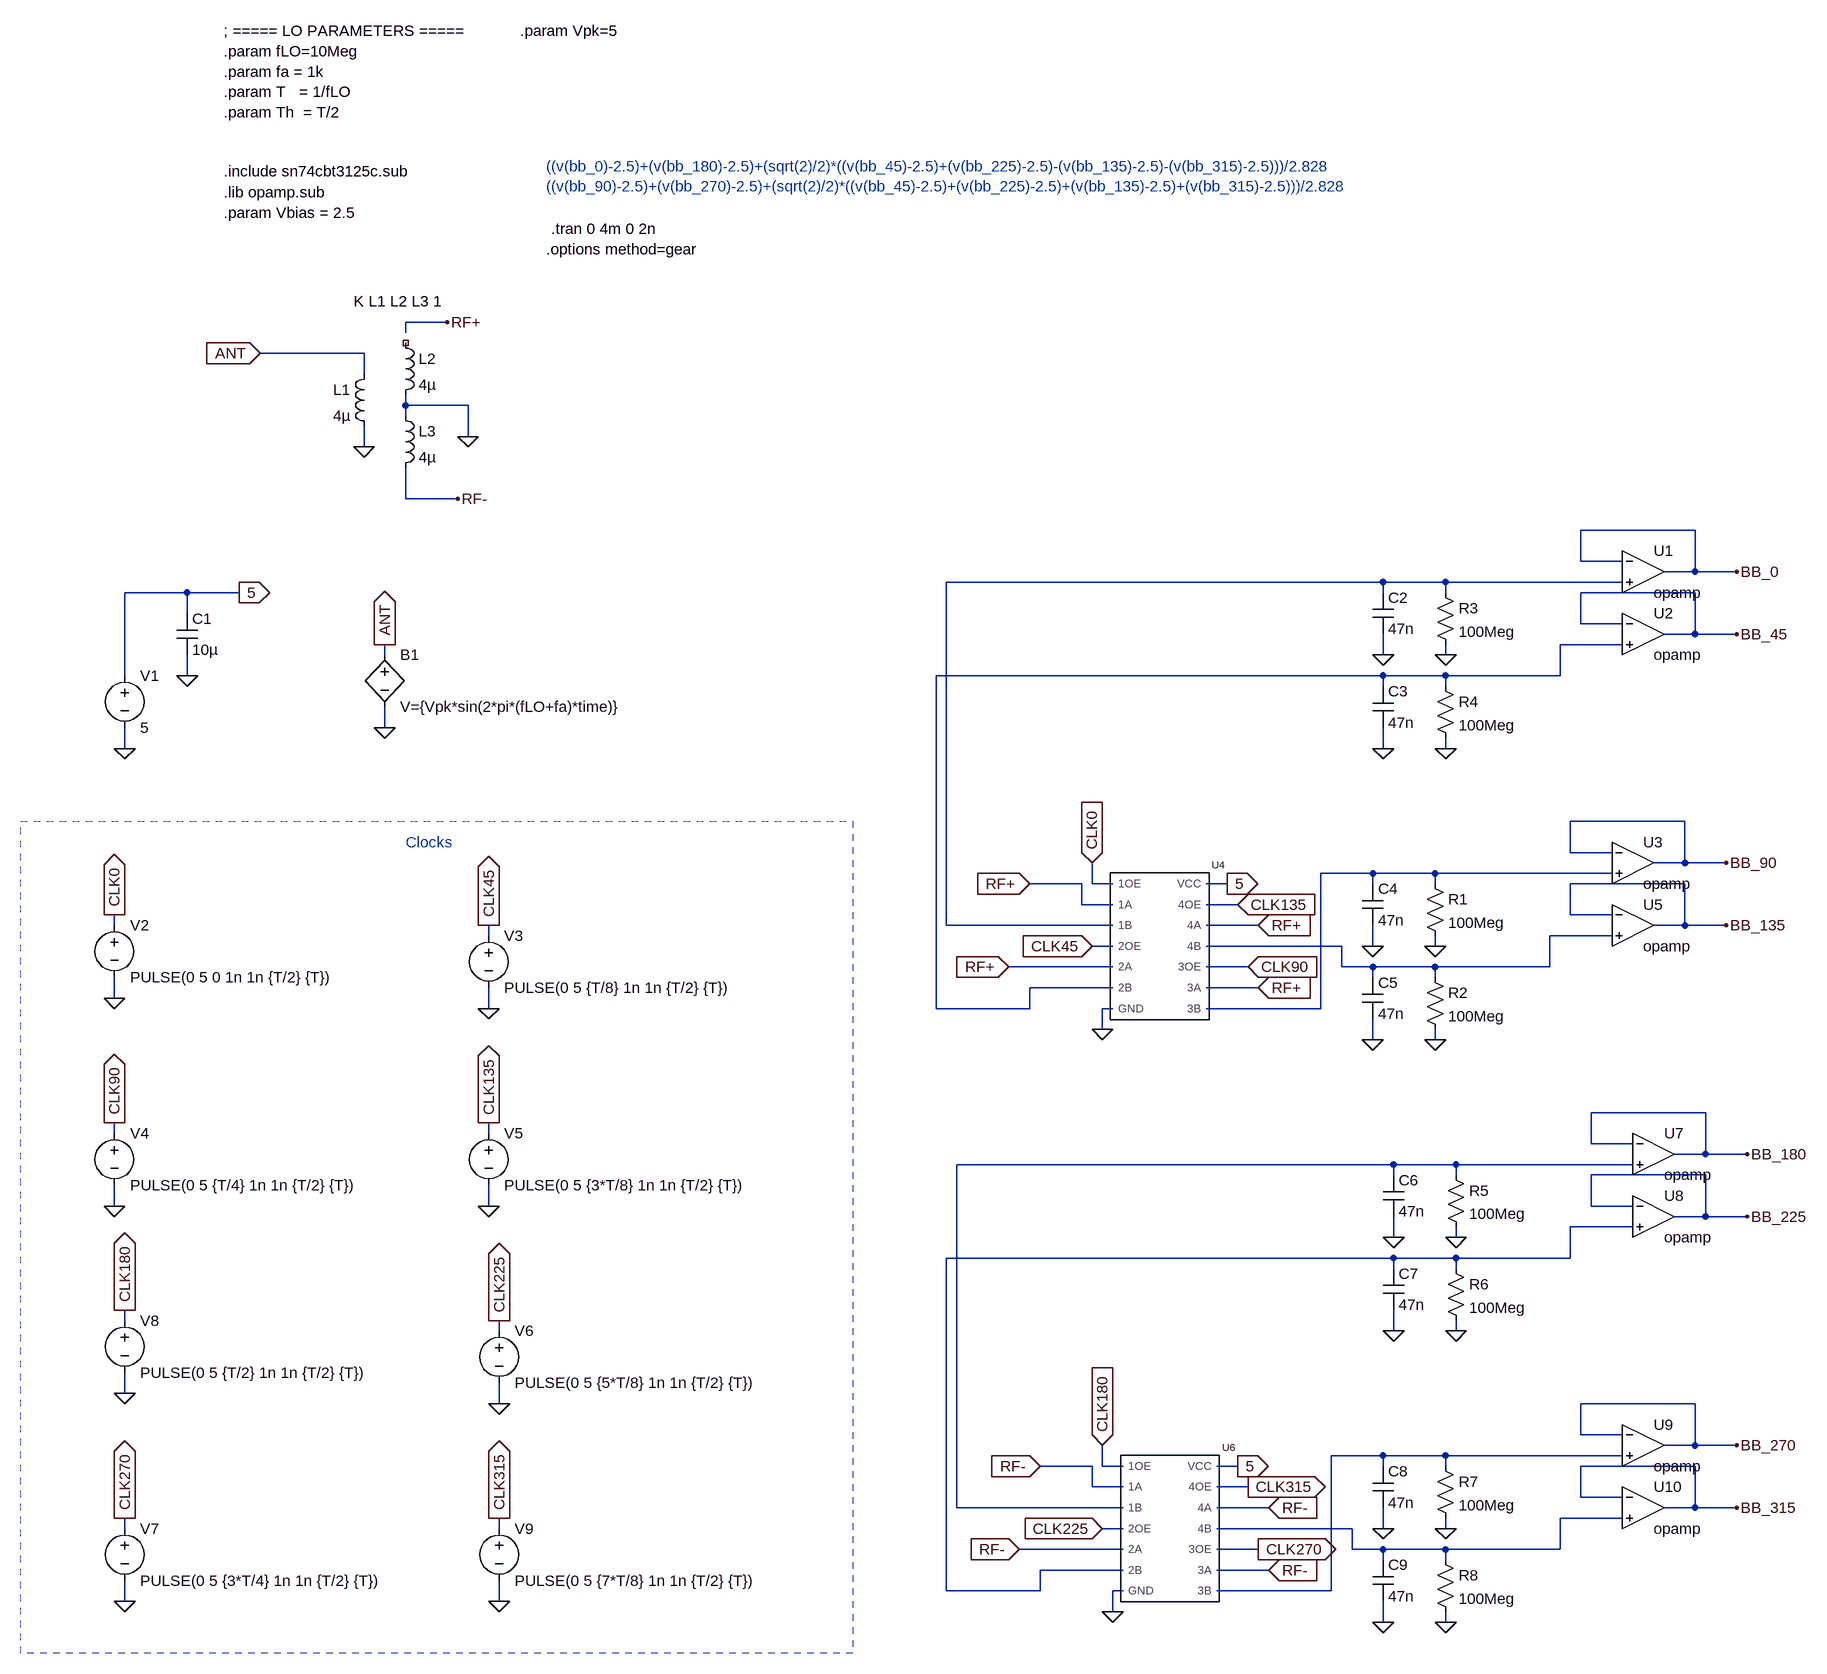
[diagram p0: schematic sn74cbt3125c_8_channel_no_differential.asc]
sn74cbt3125c_8_channel_no_differential.asc, the LTspice schematic file:
Version 4.1
SHEET 1 2428 2448
WIRE 320 -656 256 -656
WIRE 256 -640 256 -656
WIRE 192 -608 32 -608
WIRE 192 -576 192 -608
WIRE 256 -528 256 -544
WIRE 352 -528 256 -528
WIRE 256 -512 256 -528
WIRE 352 -480 352 -528
WIRE 192 -464 192 -496
WIRE 256 -384 256 -432
WIRE 336 -384 256 -384
WIRE 2240 -336 2064 -336
WIRE 2064 -288 2064 -336
WIRE 2128 -288 2064 -288
WIRE 2240 -272 2240 -336
WIRE 2240 -272 2192 -272
WIRE 2304 -272 2240 -272
WIRE 1760 -256 1088 -256
WIRE 1856 -256 1760 -256
WIRE 2128 -256 1856 -256
WIRE -80 -240 -176 -240
WIRE 0 -240 -80 -240
WIRE 1760 -240 1760 -256
WIRE 1856 -240 1856 -256
WIRE 2240 -240 2064 -240
WIRE -80 -208 -80 -240
WIRE 2064 -192 2064 -240
WIRE 2128 -192 2064 -192
WIRE 2240 -176 2240 -240
WIRE 2240 -176 2192 -176
WIRE 2304 -176 2240 -176
WIRE 2128 -160 2032 -160
WIRE 224 -144 224 -160
WIRE 1760 -144 1760 -176
WIRE 1856 -144 1856 -160
WIRE -176 -112 -176 -240
WIRE -80 -112 -80 -144
WIRE 1760 -112 1072 -112
WIRE 1856 -112 1760 -112
WIRE 2032 -112 2032 -160
WIRE 2032 -112 1856 -112
WIRE 1760 -96 1760 -112
WIRE 1856 -96 1856 -112
WIRE 224 -32 224 -64
WIRE -176 0 -176 -32
WIRE 1760 0 1760 -32
WIRE 1856 0 1856 -16
WIRE 2224 112 2048 112
WIRE 2048 160 2048 112
WIRE 2112 160 2048 160
WIRE 2224 176 2224 112
WIRE 2224 176 2176 176
WIRE 2288 176 2224 176
WIRE 1744 192 1664 192
WIRE 1840 192 1744 192
WIRE 2112 192 1840 192
WIRE 1296 208 1216 208
WIRE 1312 208 1312 176
WIRE 1344 208 1312 208
WIRE 1520 208 1488 208
WIRE 1744 208 1744 192
WIRE 1840 208 1840 192
WIRE 2224 208 2048 208
WIRE 1296 240 1296 208
WIRE 1344 240 1296 240
WIRE 1536 240 1488 240
WIRE 2048 256 2048 208
WIRE 2112 256 2048 256
WIRE -192 272 -192 256
WIRE 1088 272 1088 -256
WIRE 1344 272 1088 272
WIRE 1568 272 1488 272
WIRE 2224 272 2224 208
WIRE 2224 272 2176 272
WIRE 2288 272 2224 272
WIRE 384 288 384 272
WIRE 2112 288 2016 288
WIRE 1344 304 1312 304
WIRE 1696 304 1488 304
WIRE 1744 304 1744 272
WIRE 1840 304 1840 288
WIRE 1344 336 1184 336
WIRE 1552 336 1488 336
WIRE 1696 336 1696 304
WIRE 1744 336 1696 336
WIRE 1840 336 1744 336
WIRE 2016 336 2016 288
WIRE 2016 336 1840 336
WIRE 1744 352 1744 336
WIRE 1840 352 1840 336
WIRE 1344 368 1216 368
WIRE 1568 368 1488 368
WIRE -192 384 -192 352
WIRE 384 400 384 368
WIRE 1072 400 1072 -112
WIRE 1216 400 1216 368
WIRE 1216 400 1072 400
WIRE 1344 400 1328 400
WIRE 1664 400 1664 192
WIRE 1664 400 1488 400
WIRE 1328 432 1328 400
WIRE 1744 448 1744 416
WIRE 1840 448 1840 432
WIRE 2256 560 2080 560
WIRE -192 592 -192 576
WIRE 384 592 384 576
WIRE 2080 608 2080 560
WIRE 2144 608 2080 608
WIRE 2256 624 2256 560
WIRE 2256 624 2208 624
WIRE 2320 624 2256 624
WIRE 1776 640 1104 640
WIRE 1872 640 1776 640
WIRE 2144 640 1872 640
WIRE 1776 656 1776 640
WIRE 1872 656 1872 640
WIRE 2256 656 2080 656
WIRE -192 704 -192 672
WIRE 384 704 384 672
WIRE 2080 704 2080 656
WIRE 2144 704 2080 704
WIRE 2256 720 2256 656
WIRE 2256 720 2208 720
WIRE 2320 720 2256 720
WIRE 2144 736 2048 736
WIRE 1776 752 1776 720
WIRE 1872 752 1872 736
WIRE 1776 784 1088 784
WIRE 1872 784 1776 784
WIRE 2048 784 2048 736
WIRE 2048 784 1872 784
WIRE 1776 800 1776 784
WIRE 1872 800 1872 784
WIRE -176 880 -176 864
WIRE 400 896 400 880
WIRE 1776 896 1776 864
WIRE 1872 896 1872 880
WIRE -176 992 -176 960
WIRE 400 1008 400 976
WIRE 2240 1008 2064 1008
WIRE 2064 1056 2064 1008
WIRE 2128 1056 2064 1056
WIRE 2240 1072 2240 1008
WIRE 2240 1072 2192 1072
WIRE 2304 1072 2240 1072
WIRE 1760 1088 1680 1088
WIRE 1856 1088 1760 1088
WIRE 2128 1088 1856 1088
WIRE 1312 1104 1232 1104
WIRE 1328 1104 1328 1072
WIRE 1360 1104 1328 1104
WIRE 1536 1104 1504 1104
WIRE 1760 1104 1760 1088
WIRE 1856 1104 1856 1088
WIRE 2240 1104 2064 1104
WIRE 1312 1136 1312 1104
WIRE 1360 1136 1312 1136
WIRE 1552 1136 1504 1136
WIRE 2064 1152 2064 1104
WIRE 2128 1152 2064 1152
WIRE 1104 1168 1104 640
WIRE 1360 1168 1104 1168
WIRE 1584 1168 1504 1168
WIRE 2240 1168 2240 1104
WIRE 2240 1168 2192 1168
WIRE 2304 1168 2240 1168
WIRE 2128 1184 2032 1184
WIRE -176 1200 -176 1184
WIRE 400 1200 400 1184
WIRE 1360 1200 1328 1200
WIRE 1712 1200 1504 1200
WIRE 1760 1200 1760 1168
WIRE 1856 1200 1856 1184
WIRE 1360 1232 1200 1232
WIRE 1568 1232 1504 1232
WIRE 1712 1232 1712 1200
WIRE 1760 1232 1712 1232
WIRE 1856 1232 1760 1232
WIRE 2032 1232 2032 1184
WIRE 2032 1232 1856 1232
WIRE 1760 1248 1760 1232
WIRE 1856 1248 1856 1232
WIRE 1360 1264 1232 1264
WIRE 1584 1264 1504 1264
WIRE 1088 1296 1088 784
WIRE 1232 1296 1232 1264
WIRE 1232 1296 1088 1296
WIRE 1360 1296 1344 1296
WIRE 1680 1296 1680 1088
WIRE 1680 1296 1504 1296
WIRE -176 1312 -176 1280
WIRE 400 1312 400 1280
WIRE 1344 1328 1344 1296
WIRE 1760 1344 1760 1312
WIRE 1856 1344 1856 1328
FLAG -176 0 0
FLAG 384 400 0
FLAG 224 -32 0
FLAG 0 -240 5
IOPIN 0 -240 Out
FLAG 224 -160 ANT
IOPIN 224 -160 Out
FLAG 1216 208 RF+
IOPIN 1216 208 In
FLAG -192 576 CLK90
IOPIN -192 576 Out
FLAG 1312 176 CLK0
IOPIN 1312 176 In
FLAG 1328 432 0
FLAG 1312 304 CLK45
IOPIN 1312 304 In
FLAG -80 -112 0
FLAG 1184 336 RF+
IOPIN 1184 336 In
FLAG -192 704 0
FLAG 384 272 CLK45
IOPIN 384 272 Out
FLAG 1760 -144 0
FLAG 1856 -144 0
FLAG 1760 0 0
FLAG 1856 0 0
FLAG 2304 -272 BB_0
FLAG 2304 -176 BB_45
FLAG 1744 304 0
FLAG 1840 304 0
FLAG 1744 448 0
FLAG 1840 448 0
FLAG 2288 176 BB_90
FLAG 2288 272 BB_135
FLAG -192 256 CLK0
IOPIN -192 256 Out
FLAG -192 384 0
FLAG 384 576 CLK135
IOPIN 384 576 Out
FLAG 384 704 0
FLAG 1552 336 CLK90
IOPIN 1552 336 In
FLAG 1520 208 5
IOPIN 1520 208 Out
FLAG 1536 240 CLK135
IOPIN 1536 240 In
FLAG 1568 368 RF+
IOPIN 1568 368 In
FLAG 1568 272 RF+
IOPIN 1568 272 In
FLAG 400 1008 0
FLAG -176 1184 CLK270
IOPIN -176 1184 Out
FLAG -176 1312 0
FLAG 400 880 CLK225
IOPIN 400 880 Out
FLAG -176 864 CLK180
IOPIN -176 864 Out
FLAG -176 992 0
FLAG 400 1184 CLK315
IOPIN 400 1184 Out
FLAG 400 1312 0
FLAG 1232 1104 RF-
IOPIN 1232 1104 In
FLAG 1328 1072 CLK180
IOPIN 1328 1072 In
FLAG 1344 1328 0
FLAG 1328 1200 CLK225
IOPIN 1328 1200 In
FLAG 1200 1232 RF-
IOPIN 1200 1232 In
FLAG 1776 752 0
FLAG 1872 752 0
FLAG 1776 896 0
FLAG 1872 896 0
FLAG 2320 624 BB_180
FLAG 2320 720 BB_225
FLAG 1760 1200 0
FLAG 1856 1200 0
FLAG 1760 1344 0
FLAG 1856 1344 0
FLAG 2304 1072 BB_270
FLAG 2304 1168 BB_315
FLAG 1568 1232 CLK270
IOPIN 1568 1232 Out
FLAG 1536 1104 5
IOPIN 1536 1104 Out
FLAG 1552 1136 CLK315
IOPIN 1552 1136 Out
FLAG 1584 1264 RF-
IOPIN 1584 1264 In
FLAG 1584 1168 RF-
IOPIN 1584 1168 In
FLAG 192 -464 0
FLAG 320 -656 RF+
FLAG 32 -608 ANT
IOPIN 32 -608 In
FLAG 336 -384 RF-
FLAG 352 -480 0
SYMBOL sn74cbt3125casy 1440 272 R0
SYMATTR InstName U4
SYMBOL voltage -176 -128 R0
WINDOW 123 0 0 Left 0
WINDOW 39 0 0 Left 0
SYMATTR InstName V1
SYMATTR Value 5
SYMBOL voltage 384 272 R0
WINDOW 123 0 0 Left 0
WINDOW 39 0 0 Left 0
SYMATTR InstName V3
SYMATTR Value PULSE(0 5 {T/8} 1n 1n {T/2} {T})
SYMBOL cap -96 -208 R0
SYMATTR InstName C1
SYMATTR Value 10µ
SYMBOL voltage -192 576 R0
WINDOW 123 0 0 Left 0
WINDOW 39 0 0 Left 0
SYMATTR InstName V4
SYMATTR Value PULSE(0 5 {T/4} 1n 1n {T/2} {T})
SYMBOL OpAmps\\opamp 2160 -336 R0
SYMATTR InstName U1
SYMBOL OpAmps\\opamp 2160 -240 R0
SYMATTR InstName U2
SYMBOL cap 1744 -240 R0
SYMATTR InstName C2
SYMATTR Value 47n
SYMBOL res 1840 -256 R0
SYMATTR InstName R3
SYMATTR Value 100Meg
SYMBOL cap 1744 -96 R0
SYMATTR InstName C3
SYMATTR Value 47n
SYMBOL res 1840 -112 R0
SYMATTR InstName R4
SYMATTR Value 100Meg
SYMBOL bv 224 -160 R0
SYMATTR InstName B1
SYMATTR Value V={Vpk*sin(2*pi*(fLO+fa)*time)}
SYMBOL OpAmps\\opamp 2144 112 R0
SYMATTR InstName U3
SYMBOL OpAmps\\opamp 2144 208 R0
SYMATTR InstName U5
SYMBOL cap 1728 208 R0
SYMATTR InstName C4
SYMATTR Value 47n
SYMBOL res 1824 192 R0
SYMATTR InstName R1
SYMATTR Value 100Meg
SYMBOL cap 1728 352 R0
SYMATTR InstName C5
SYMATTR Value 47n
SYMBOL res 1824 336 R0
SYMATTR InstName R2
SYMATTR Value 100Meg
SYMBOL voltage -192 256 R0
WINDOW 123 0 0 Left 0
WINDOW 39 0 0 Left 0
SYMATTR InstName V2
SYMATTR Value PULSE(0 5 0 1n 1n {T/2} {T})
SYMBOL voltage 384 576 R0
WINDOW 123 0 0 Left 0
WINDOW 39 0 0 Left 0
SYMATTR InstName V5
SYMATTR Value PULSE(0 5 {3*T/8} 1n 1n {T/2} {T})
SYMBOL voltage 400 880 R0
WINDOW 123 0 0 Left 0
WINDOW 39 0 0 Left 0
SYMATTR InstName V6
SYMATTR Value PULSE(0 5 {5*T/8} 1n 1n {T/2} {T})
SYMBOL voltage -176 1184 R0
WINDOW 123 0 0 Left 0
WINDOW 39 0 0 Left 0
SYMATTR InstName V7
SYMATTR Value PULSE(0 5 {3*T/4} 1n 1n {T/2} {T})
SYMBOL voltage -176 864 R0
WINDOW 123 0 0 Left 0
WINDOW 39 0 0 Left 0
SYMATTR InstName V8
SYMATTR Value PULSE(0 5 {T/2} 1n 1n {T/2} {T})
SYMBOL voltage 400 1184 R0
WINDOW 123 0 0 Left 0
WINDOW 39 0 0 Left 0
SYMATTR InstName V9
SYMATTR Value PULSE(0 5 {7*T/8} 1n 1n {T/2} {T})
SYMBOL sn74cbt3125casy 1456 1168 R0
SYMATTR InstName U6
SYMBOL OpAmps\\opamp 2176 560 R0
SYMATTR InstName U7
SYMBOL OpAmps\\opamp 2176 656 R0
SYMATTR InstName U8
SYMBOL cap 1760 656 R0
SYMATTR InstName C6
SYMATTR Value 47n
SYMBOL res 1856 640 R0
SYMATTR InstName R5
SYMATTR Value 100Meg
SYMBOL cap 1760 800 R0
SYMATTR InstName C7
SYMATTR Value 47n
SYMBOL res 1856 784 R0
SYMATTR InstName R6
SYMATTR Value 100Meg
SYMBOL OpAmps\\opamp 2160 1008 R0
SYMATTR InstName U9
SYMBOL OpAmps\\opamp 2160 1104 R0
SYMATTR InstName U10
SYMBOL cap 1744 1104 R0
SYMATTR InstName C8
SYMATTR Value 47n
SYMBOL res 1840 1088 R0
SYMATTR InstName R7
SYMATTR Value 100Meg
SYMBOL cap 1744 1248 R0
SYMATTR InstName C9
SYMATTR Value 47n
SYMBOL res 1840 1232 R0
SYMATTR InstName R8
SYMATTR Value 100Meg
SYMBOL ind 208 -592 M0
SYMATTR InstName L1
SYMATTR Value 4µ
SYMATTR Type ind
SYMATTR SpiceLine Rser=1m
SYMBOL ind 240 -640 R0
SYMATTR InstName L2
SYMATTR Value 4µ
SYMATTR Type ind
SYMATTR SpiceLine Rser=1m
SYMBOL ind 240 -528 R0
SYMATTR InstName L3
SYMATTR Value 4µ
SYMATTR Type ind
SYMATTR SpiceLine Rser=1m
TEXT 480 -800 Left 2 !.tran 0 4m 0 2n
TEXT 472 -768 Left 2 !.options method=gear
TEXT -24 -888 Left 2 !.include sn74cbt3125c.sub
TEXT -24 -856 Left 2 !.lib opamp.sub
TEXT -24 -1104 Left 2 !; ===== LO PARAMETERS =====\n.param fLO=10Meg\n.param fa = 1k\n.param T   = 1/fLO\n.param Th  = T/2
TEXT 432 -1104 Left 2 !.param Vpk=5
TEXT 472 -896 Left 2 ;((v(bb_0)-2.5)+(v(bb_180)-2.5)+(sqrt(2)/2)*((v(bb_45)-2.5)+(v(bb_225)-2.5)-(v(bb_135)-2.5)-(v(bb_315)-2.5)))/2.828\n((v(bb_90)-2.5)+(v(bb_270)-2.5)+(sqrt(2)/2)*((v(bb_45)-2.5)+(v(bb_225)-2.5)+(v(bb_135)-2.5)+(v(bb_315)-2.5)))/2.828
TEXT 256 144 Left 2 ;Clocks
TEXT 176 -688 Left 2 !K L1 L2 L3 1
TEXT -24 -824 Left 2 !.param Vbias = 2.5
RECTANGLE Normal 944 1392 -336 112 2

The netlist it stands for:
* sn74cbt3125c_8_channel_no_differential.asc
X§U4 CLK0 RF+ N001 CLK45 RF+ N002 0 N003 RF+ CLK90 N004 RF+ CLK135 5 SN74CBT3125C  ; pins 1OE 1A 1B 2OE 2A 2B GND 3B 3A 3OE 4B 4A 4OE VCC
V1 5 0 5
V3 CLK45 0 PULSE(0 5 {T/8} 1n 1n {T/2} {T})
C1 5 0 10µ
V4 CLK90 0 PULSE(0 5 {T/4} 1n 1n {T/2} {T})
X§U1 BB_0 N001 BB_0 opamp Aol=100K GBW=10Meg  ; pins invin noninvin out
X§U2 BB_45 N002 BB_45 opamp Aol=100K GBW=10Meg  ; pins invin noninvin out
C2 N001 0 47n
R3 N001 0 100Meg
C3 N002 0 47n
R4 N002 0 100Meg
B1 ANT 0 V={Vpk*sin(2*pi*(fLO+fa)*time)}
X§U3 BB_90 N003 BB_90 opamp Aol=100K GBW=10Meg  ; pins invin noninvin out
X§U5 BB_135 N004 BB_135 opamp Aol=100K GBW=10Meg  ; pins invin noninvin out
C4 N003 0 47n
R1 N003 0 100Meg
C5 N004 0 47n
R2 N004 0 100Meg
V2 CLK0 0 PULSE(0 5 0 1n 1n {T/2} {T})
V5 CLK135 0 PULSE(0 5 {3*T/8} 1n 1n {T/2} {T})
V6 CLK225 0 PULSE(0 5 {5*T/8} 1n 1n {T/2} {T})
V7 CLK270 0 PULSE(0 5 {3*T/4} 1n 1n {T/2} {T})
V8 CLK180 0 PULSE(0 5 {T/2} 1n 1n {T/2} {T})
V9 CLK315 0 PULSE(0 5 {7*T/8} 1n 1n {T/2} {T})
X§U6 CLK180 RF- N005 CLK225 RF- N006 0 N007 RF- CLK270 N008 RF- CLK315 5 SN74CBT3125C  ; pins 1OE 1A 1B 2OE 2A 2B GND 3B 3A 3OE 4B 4A 4OE VCC
X§U7 BB_180 N005 BB_180 opamp Aol=100K GBW=10Meg  ; pins invin noninvin out
X§U8 BB_225 N006 BB_225 opamp Aol=100K GBW=10Meg  ; pins invin noninvin out
C6 N005 0 47n
R5 N005 0 100Meg
C7 N006 0 47n
R6 N006 0 100Meg
X§U9 BB_270 N007 BB_270 opamp Aol=100K GBW=10Meg  ; pins invin noninvin out
X§U10 BB_315 N008 BB_315 opamp Aol=100K GBW=10Meg  ; pins invin noninvin out
C8 N007 0 47n
R7 N007 0 100Meg
C9 N008 0 47n
R8 N008 0 100Meg
L1 ANT 0 4µ Rser=1m
L2 NC_01 0 4µ Rser=1m
L3 0 RF- 4µ Rser=1m
.tran 0 4m 0 2n
.options method=gear
.include sn74cbt3125c.sub
.lib opamp.sub
; ===== LO PARAMETERS =====
.param fLO=10Meg
.param fa = 1k
.param T   = 1/fLO
.param Th  = T/2
.param Vpk=5
* ((v(bb_0)-2.5)+(v(bb_180)-2.5)+(sqrt(2)/2)*((v(bb_45)-2.5)+(v(bb_225)-2.5)-(v(bb_135)-2.5)-(v(bb_315)-2.5)))/2.828
* ((v(bb_90)-2.5)+(v(bb_270)-2.5)+(sqrt(2)/2)*((v(bb_45)-2.5)+(v(bb_225)-2.5)+(v(bb_135)-2.5)+(v(bb_315)-2.5)))/2.828
* Clocks
K L1 L2 L3 1
.param Vbias = 2.5
.backanno
.end